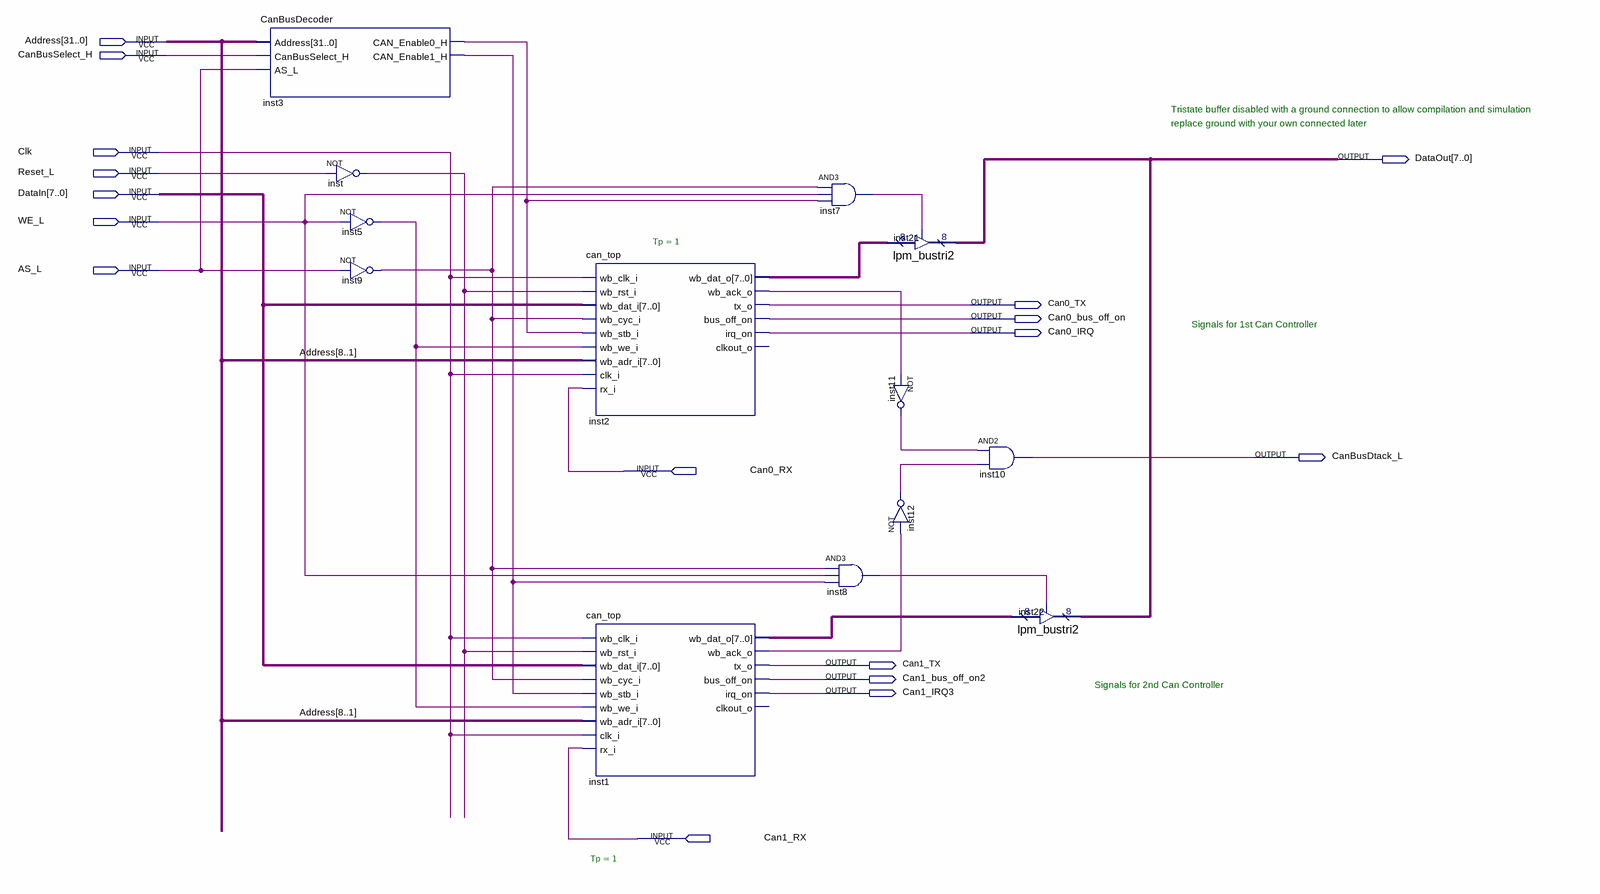
[diagram p0: schematic sheet]
// Quartus schematic CanBus.bdf as structural Verilog: 13 symbols, 17 pins
module CanBus (
  input  [31:0] Address,
  input  CanBusSelect_H,
  input  Clk,
  input  Reset_L,
  input  [7:0] DataIn,
  input  WE_L,
  input  AS_L,
  input  Can0_RX,
  input  Can1_RX,
  output [7:0] DataOut,
  output Can0_TX,
  output Can0_bus_off_on,
  output Can0_IRQ,
  output CanBusDtack_L,
  output Can1_TX,
  output Can1_bus_off_on2,
  output Can1_IRQ3
);

  wire inst1_wb_ack_o, inst2_wb_ack_o, inst3_can_enable0_h, inst3_can_enable1_h, inst5_out, inst7_out,
       inst8_out, inst9_out, inst11_out, inst12_out, inst_out;
  wire [7:0] inst1_wb_dat_o, inst2_wb_dat_o;

  CanBusDecoder inst3 (
    .Address(Address), .CanBusSelect_H(CanBusSelect_H), .AS_L(AS_L), .CAN_Enable0_H(inst3_can_enable0_h),
    .CAN_Enable1_H(inst3_can_enable1_h));
  not inst (inst_out, Reset_L);
  not inst5 (inst5_out, WE_L);
  not inst9 (inst9_out, AS_L);
  can_top #(.Tp(1)) inst2 (
    .wb_clk_i(Clk), .wb_rst_i(inst_out), .wb_dat_i(DataIn), .wb_cyc_i(inst9_out),
    .wb_stb_i(inst3_can_enable0_h), .wb_we_i(inst5_out), .wb_adr_i(Address[8:1]), .clk_i(Clk),
    .rx_i(Can0_RX), .wb_dat_o(inst2_wb_dat_o), .wb_ack_o(inst2_wb_ack_o), .tx_o(Can0_TX),
    .bus_off_on(Can0_bus_off_on), .irq_on(Can0_IRQ));  // open: clkout_o
  can_top #(.Tp(1)) inst1 (
    .wb_clk_i(Clk), .wb_rst_i(inst_out), .wb_dat_i(DataIn), .wb_cyc_i(inst9_out),
    .wb_stb_i(inst3_can_enable1_h), .wb_we_i(inst5_out), .wb_adr_i(Address[8:1]), .clk_i(Clk),
    .rx_i(Can1_RX), .wb_dat_o(inst1_wb_dat_o), .wb_ack_o(inst1_wb_ack_o), .tx_o(Can1_TX),
    .bus_off_on(Can1_bus_off_on2), .irq_on(Can1_IRQ3));  // open: clkout_o
  and inst7 (inst7_out, inst9_out, WE_L, inst3_can_enable0_h);
  and inst8 (inst8_out, inst9_out, WE_L, inst3_can_enable1_h);
  lpm_bustri2 inst21 (.enabledt(inst7_out), .data(inst2_wb_dat_o), .tridata(DataOut));
  not inst11 (inst11_out, inst2_wb_ack_o);
  not inst12 (inst12_out, inst1_wb_ack_o);
  and inst10 (CanBusDtack_L, inst11_out, inst12_out);
  lpm_bustri2 inst22 (.enabledt(inst8_out), .data(inst1_wb_dat_o), .tridata(DataOut));

  // Notes on the sheet:
  //   Tristate buffer disabled with a ground connection to allow compilation and simulation
  //   replace ground with your own connected later
  //   Signals for 1st Can Controller
  //   Signals for 2nd Can Controller
endmodule
